# Altium schematic sheet Control.SchDoc
size A4
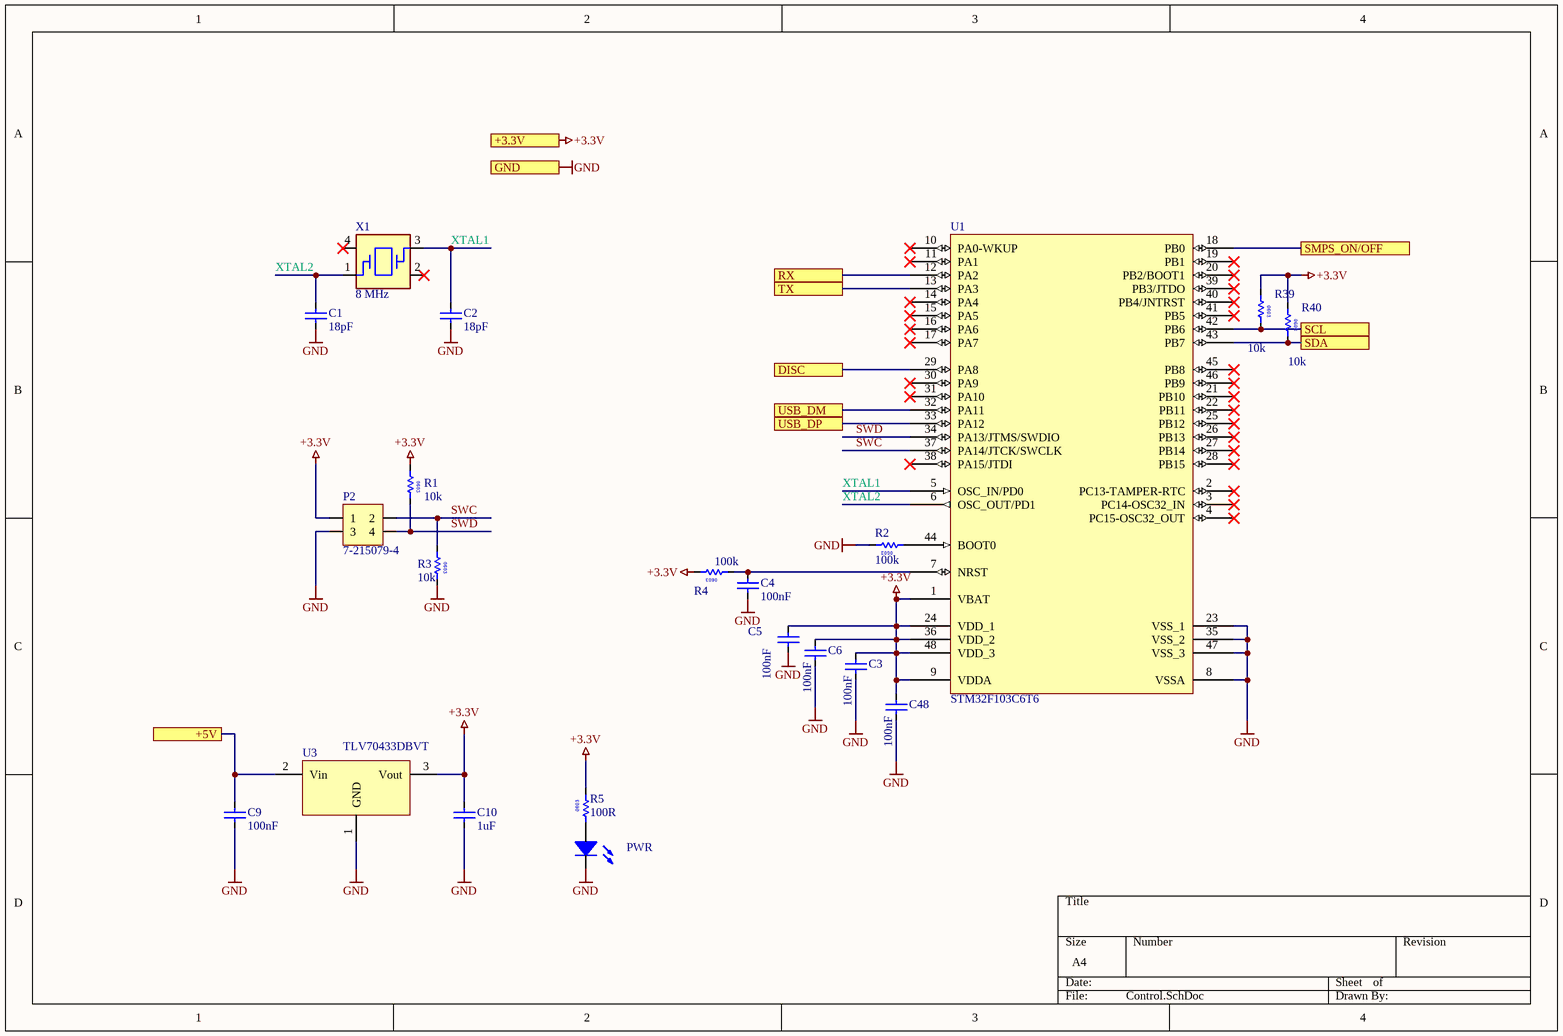
[diagram p0: Control.SchDoc]

## Parts
C1  18pF  [CAPC1608N]
C2  18pF  [CAPC1608N]
C3  100nF  [C0603V]
C4  100nF  [C0603V]
C5  100nF  [C0603V]
C6  100nF  [C0603V]
C9  100nF  [C0603V]
C10  1uF  [CAPC2012N]
C48  100nF  [C0603V]
P2  7-215079-4  [ZIP-T4]
PWR  KPHCM-2012SGC-T  [D0805]  (value not drawn)
R1  10k  [RESC1608N]
R2  100k  [RESC1608N]
R3  10k  [RESC1608N]
R4  100k  [RESC1608N]
R5  100R  [RESC1608N]
R39  10k  [RESC1608N]
R40  10k  [RESC1608N]
U1  STM32F103C6T6  [LQFP48_N]
U3  TLV70433DBVT  [SO-G5/P.95]
X1  8 MHz  [2SMX-3SMXB]

## Ports
+3.3V, +5V, DISC, GND, RX, SCL, SDA, SMPS_ON/OFF, TX, USB_DM, USB_DP

## Nets
+3.3V: C3.2 C5.2 C6.2 C10.2 C48.2 P2.1 R1.1 R4.2 R5.2 R39.1 R40.1 U1.1(VBAT) U1.9(VDDA) U1.24(VDD_1) U1.36(VDD_2) U1.48(VDD_3) U3.3(Vout) ; port +3.3V
GND: C1.1 C2.1 C3.1 C4.1 C5.1 C6.1 C9.1 C10.1 C48.1 P2.3 PWR.2 R2.2 R3.2 U1.8(VSSA) U1.23(VSS_1) U1.35(VSS_2) U1.47(VSS_3) U3.1(GND) ; port GND
+5V: C9.2 U3.2(Vin) ; port +5V
DISC: U1.29(PA8) ; port DISC
RX: U1.12(PA2) ; port RX
SCL: R39.2 U1.42(PB6) ; port SCL
SDA: R40.2 U1.43(PB7) ; port SDA
SMPS_ON/OFF: U1.18(PB0) ; port SMPS_ON/OFF
SWC: P2.2 R3.1 U1.37(PA14/JTCK/SWCLK)
SWD: P2.4 R1.2 U1.34(PA13/JTMS/SWDIO)
TX: U1.13(PA3) ; port TX
USB_DM: U1.32(PA11) ; port USB_DM
USB_DP: U1.33(PA12) ; port USB_DP
XTAL1: C2.2 U1.5(OSC_IN/PD0) X1.3
XTAL2: C1.2 U1.6(OSC_OUT/PD1) X1.1
NetC4_2: C4.2 R4.1 U1.7(NRST)
NetPWR_1: PWR.1 R5.1
NetR2_1: R2.1 U1.44(BOOT0)

Not connected (* = marked no-connect by the designer): U1 2(PC13-TAMPER-RTC)* 3(PC14-OSC32_IN)* 4(PC15-OSC32_OUT)* 10(PA0-WKUP)* 11(PA1)* 14(PA4)* 15(PA5)* 16(PA6)* 17(PA7)* 19(PB1)* 20(PB2/BOOT1)* 21(PB10)* 22(PB11)* 25(PB12)* 26(PB13)* 27(PB14)* 28(PB15)* 30(PA9)* 31(PA10)* 38(PA15/JTDI)* 39(PB3/JTDO)* 40(PB4/JNTRST)* 41(PB5)* 45(PB8)* 46(PB9)*; X1 2* 4*

## Notes on the sheet
- (in symbol R0000008) 0603
- (in symbol R2406048) 0603
- (in symbol R2406120) 0603

## Library data of the parts
C1 C2 = C0000124: MLCC, 18 pF, ± 5%, C0G / NP0, 50 V, 0603; Manufacturer: MULTICOMP; Manufacturer Part Number: MC0603N180J500CT; Voltage: 50; Part Number: C0000124; Part Type: MLCC; Tolerance: ±5%; Material: C0G / NP0; Package: 0603 (1608 metric); SMD: Yes; Supplier 1: Farnell; Supplier Part Number 1: 1759056; ComponentLink1Description: MFG link; ComponentLink1URL: http://www.farnell.com/datasheets/1901289.pdf; Data: 2016.03.08
C3-C6 C9 C48 = C0000005: MLCC, 0.1uF 16V 10% X7R 0603; Manufacturer: KEMET; Manufacturer Part Number: C0603C104K4RACTU; Voltage: 16; Project: AUT-RX03-00; Note: 0,041 €; Part Number: C0000005; Part Type: MLCC; Tolerance: 10%; Material: X7R; Package: 0603 (1608 metric); SMD: Yes; Supplier 1: Farnell; Supplier Part Number 1: 1414610RL; Supplier 2: Mouser; Supplier Part Number 2: 80-C0603C104K4R; ComponentLink1Description: MFG link; ComponentLink1URL: http://www.kemet.com/datasheets&C0603C104K4RACTU; Data: 2011.02.27
C10 = C0000037: MLCC, 0805, X5R, 16V, 1UF; Manufacturer: MULTICOMP; Manufacturer Part Number: MCCA000596; Voltage: 16; Tolerance: ±10%; Project: Zhilinskas_I/II/III; Part Number: C0000037; Part Type: MLCC; Material: X5R; Package: 0805 (2012 metric); SMD: Yes; Supplier 1: Farnell; Supplier Part Number 1: 1759479; Price: 0,033; MOQ: 1; Supplier 2: Mouser; Supplier Part Number 2: 77-VJ0805V105ZXJCBC; ComponentLink1Description: MFG link; ComponentLink1URL: http://www.farnell.com/datasheets/462001.pdf; Data: 2011.05.05
P2 = J0000107: Micro-match SOCKET, TOP ENTRY, 4WAY PTH, 1.27mm; Manufacturer: TE Connectivity; Gender: Female; Note: S; Manufacturer Code: *; Notes: *; Aproved: -; Part Number: J0000107; Part Type: Connector\MiniHeader; Orientation: Straight; Pitch: 1.27mm; SMD: No; Manufacturer Part Number: 7-215079-4; Supplier 1: Farnell; Supplier Part Number 1: 148507; ComponentLink1Description: MFG link; ComponentLink1URL: http://www.tycoelectronics.com/commerce/DocumentDelivery/DDEController?Action=srchrtrv&DocNm=108-19052&DocType=Specification+Or+Standard&DocLang=English; Data: 2012.12.18
PWR = D0000030: LED, SMD, 0805, GREEN, 25mcd; Manufacturer: KINGBRIGHT; Vforvard: 2.5; Current: 20mA; Project: Zhilinskas_I/II/III; Note: S; Part Number: D0000030; Part Type: Diode\LED; Rating: 25 mcd; SMD: Yes; Manufacturer Part Number: KPHCM-2012SGC-T; ComponentLink1Description: MFG link; ComponentLink1URL: http://www.kingbright-europe.de/_daten/KPHCM-2012SGC-T(Ver.3).pdf; ComponentLink2Description: DataSheet; Data: 2011.09.15; Supplier 1: Farnell; Supplier Part Number 1: 1686074; Supplier 2: Mouser; Supplier Part Number 2: 859-LTST-C171CKT
R1 R3 R39 R40 = R0000008: Res, 10K 0.063W 75V 1%  0603; Manufacturer: MULTICOMP; Manufacturer Part Number: MCMR06X1002FTL; Project: AUT-RX03-00; Note: 0,033 €; R2408042: R0000008; Part type: Thick Film; Tolerance: ±1%; Power: 0.063W; Package: 0603 (1608 metric); SMD: Yes; Supplier 1: Farnell; Supplier Part Number 1: 2073349; Supplier 2: Mouser; Supplier Part Number 2: 594-MCT06030C1002FP5; ComponentLink1Description: Datasheet MFG; ComponentLink1URL: http://www.vishay.com/doc?28705; Data: 2011.02.28
R2 R4 = R2406120: Res, 100K 5% 0603 1/10W; Manufacturer: YAGEO; Manufacturer Part Number: RC0603FR-13100KL; Tolerance: ±1%; R2408042: R2406120; Part type: Carbon Film; Power: 1/10W; Package: 0603 (1608 metric); SMD: Yes; Supplier 1: Farnell; Supplier Part Number 1: 2309107; Supplier 2: Mouser; Supplier Part Number 2: 603-RC0603FR-13100KL; Data: 2011.01.31
R5 = R2406048: Res, 100R 5% 0603 1/10W; Manufacturer: MULTICOMP; Manufacturer Part Number: MC 0.063W 0603 5% 100R; R2408042: R2406048; Part type: MC 0.063W 0603 5% 100R; Tolerance: ±5%; Power: 1/10W; Package: 0603 (1608 metric); SMD: Yes; Supplier 1: Farnell; Supplier Part Number 1: 9331689RL; Data: 2011.01.31
U1 = STM32F103C6T6: STM32 ARM-based 32-bit MCU with 32 Kbytes Flash, 48-pin LQFP, Industrial Temperature; Published: 30-May-2008; DatasheetVersion: rev6, Mar-2008; PackageVersion: Mar-2008; PackageReference: LQFP48; Publisher: Altium Limited; PackageDescription: 48-Pin Low-Profile Quad Flat Pack, 7 x 7 mm Body, 0.5 mm Pitch (LQFP48); ComponentLink1Description: Manufacturer Link; ComponentLink1URL: www.st.com/stm32; ComponentLink2Description: Datasheet; ComponentLink2URL: http://www.st.com/stonline/products/literature/ds/13587.pdf
U3 = U0000415: LDO, 3.3V, 150MA, SOT23-5 Vin - 24V; Manufacturer: Texas Instruments; LibRef: U0000415; SMD: Yes; Manufacturer Part Number: TLV70433DBVT; Supplier 1: Farnell; Supplier Part Number 1: 2075417; ComponentLink1Description: Datasheet MFG; ComponentLink1URL: http://www.farnell.com/datasheets/1634139.pdf; ComponentLink2Description: Manufacturer Page; Data: 2012.07.31
X1 = M0000014: CRYSTAL, 8M, 18PF CL, 6X3.6MM SMT; Manufacturer: ABRACON; Manufacturer Part Number: ABMM2-8.000MHZ-E2-T; Rating: 8MHz; Tolerance: ± 20ppm; Note: 1; Part Number: M0000014; Part Type: Crystals\XTAL; SMD: Yes; Supplier 1: Farnell; Supplier Part Number 1: 1611803; Price: 2,57; MOQ: 1; Supplier 2: Mouser; Supplier Part Number 2: 815-ABMM2-8-E2T; ComponentLink1Description: MFG link; ComponentLink2Description: Datasheet PDF; ComponentLink2URL: http://www.abracon.com/Resonators/ABMM2.pdf; Qty: 7; Data: 2011.02.17